# Altium schematic sheet MCU.SchDoc
size 431 x 279 mm; SheetNumber: 2; SheetTotal: 12; ENG_APP_DATE: --/--/--; DSN_APP_DATE: --/--/--; CHK_APP_DATE: --/--/--
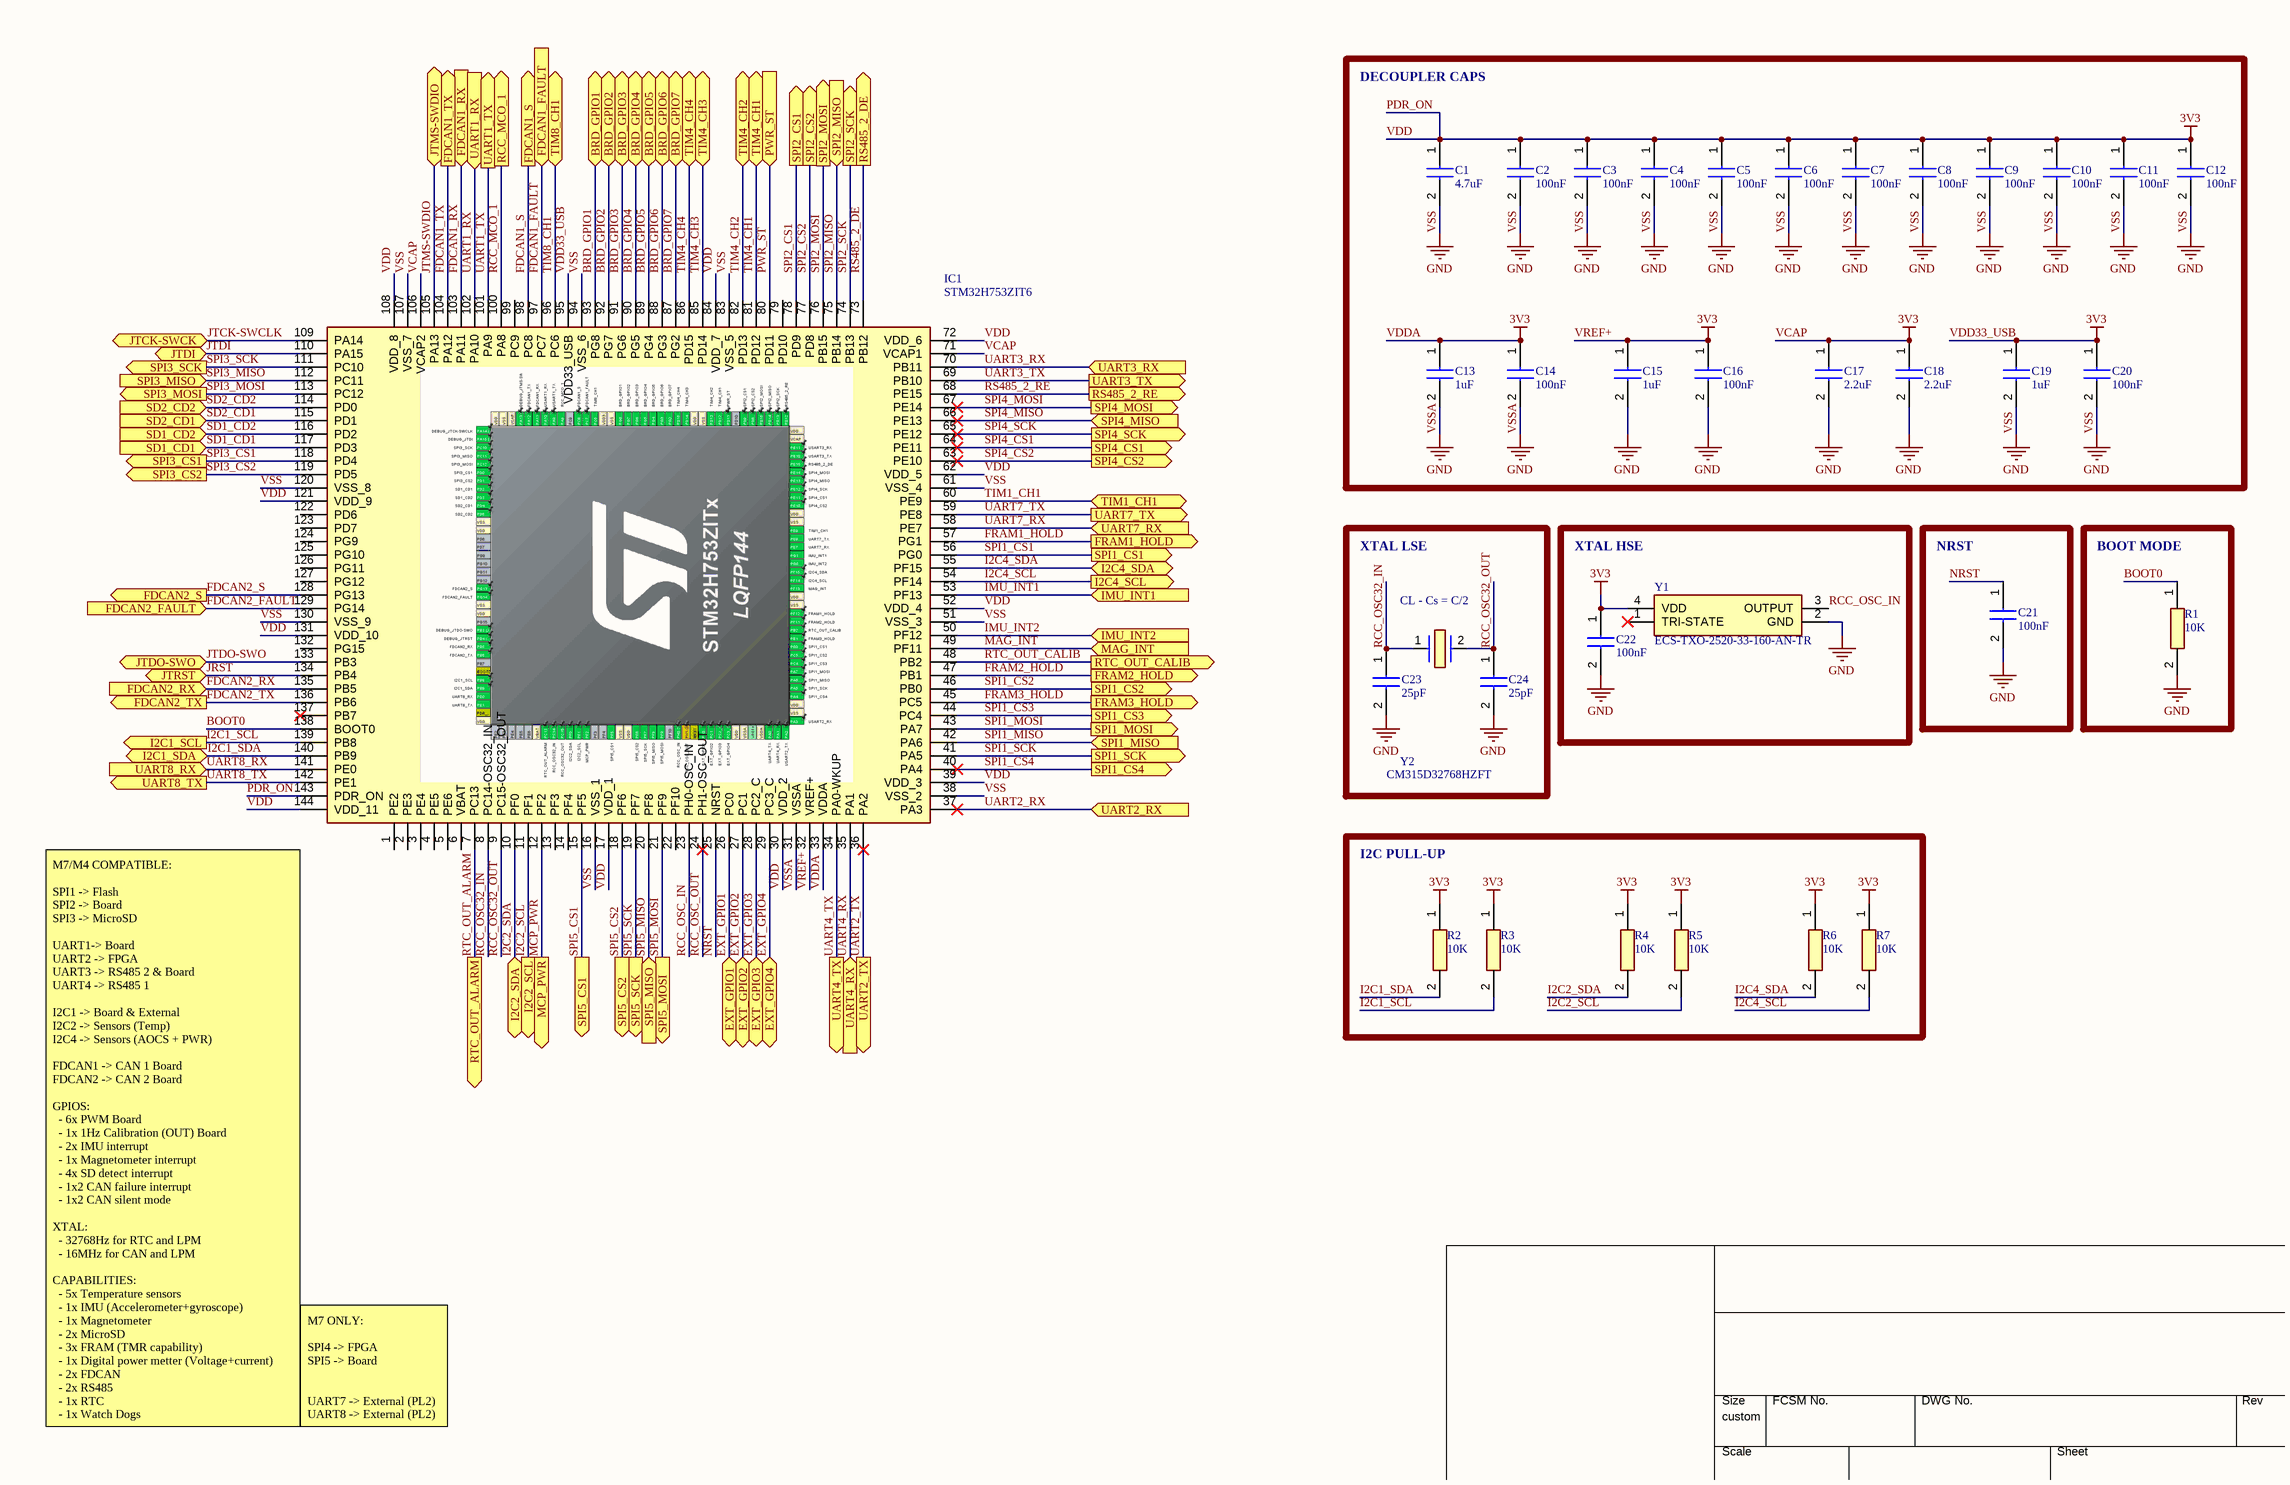
[diagram p0: MCU.SchDoc]

## Parts
C1  4.7uF  [CAPC1608X90N]
C2  100nF  [CAPC1608X95N]
C3  100nF  [CAPC1608X95N]
C4  100nF  [CAPC1608X95N]
C5  100nF  [CAPC1608X95N]
C6  100nF  [CAPC1608X95N]
C7  100nF  [CAPC1608X95N]
C8  100nF  [CAPC1608X95N]
C9  100nF  [CAPC1608X95N]
C10  100nF  [CAPC1608X95N]
C11  100nF  [CAPC1608X95N]
C12  100nF  [CAPC1608X95N]
C13  1uF  [CAPC1608X90N]
C14  100nF  [CAPC1608X95N]
C15  1uF  [CAPC1608X90N]
C16  100nF  [CAPC1608X95N]
C17  2.2uF  [CAPC1608X90N]
C18  2.2uF  [CAPC1608X90N]
C19  1uF  [CAPC1608X90N]
C20  100nF  [CAPC1608X95N]
C21  100nF  [CAPC1608X95N]
C22  100nF  [CAPC1608X95N]
C23  25pF  [CAPC1608X90N]
C24  25pF  [CAPC1608X90N]
IC1  STM32H753ZIT6  [QFP50P2200X2200X160-144N]
R1  10K  [RESC1508X50N]
R2  10K  [RESC1508X50N]
R3  10K  [RESC1508X50N]
R4  10K  [RESC1508X50N]
R5  10K  [RESC1508X50N]
R6  10K  [RESC1508X50N]
R7  10K  [RESC1508X50N]
Y1  ECS-TXO-2520-33-160-AN-TR  [ECSTXO252033160ANTR]
Y2  CM315D32768HZFT  [CM315D32768HZFT]

## Blocks framed on the sheet
DECOUPLER CAPS: C1-C20
XTAL LSE: C23 C24 Y2
XTAL HSE: C22 Y1
NRST: C21
BOOT MODE: R1
I2C PULL-UP: R2-R7

## Ports
BRD_GPIO1 (bidir), BRD_GPIO2 (bidir), BRD_GPIO3 (bidir), BRD_GPIO4 (bidir), BRD_GPIO5 (bidir), BRD_GPIO6 (bidir), BRD_GPIO7 (bidir), EXT_GPIO1 (bidir), EXT_GPIO2 (bidir), EXT_GPIO3 (bidir), EXT_GPIO4 (bidir), FDCAN1_FAULT (in), FDCAN1_RX (in), FDCAN1_S (out), FDCAN1_TX (out), FDCAN2_FAULT (in), FDCAN2_RX (in), FDCAN2_S (out), FDCAN2_TX (out), FRAM1_HOLD (out), FRAM2_HOLD (out), FRAM3_HOLD (out), I2C1_SCL (out), I2C1_SDA (bidir), I2C2_SCL (out), I2C2_SDA (bidir), I2C4_SCL (out), I2C4_SDA (bidir), IMU_INT1 (in), IMU_INT2 (in), JTCK-SWCK (bidir), JTDI (bidir), JTDO-SWO (bidir), JTMS-SWDIO (bidir), JTRST (bidir), MAG_INT (in), MCP_PWR (out), PWR_ST (in), RCC_MCO_1 (out), RS485_2_DE (out), RS485_2_RE (out), RTC_OUT_ALARM (out), RTC_OUT_CALIB (out), SD1_CD1 (in), SD1_CD2 (in), SD2_CD1 (in), SD2_CD2 (in), SPI1_CS1 (out), SPI1_CS2 (out), SPI1_CS3 (out), SPI1_CS4 (out), SPI1_MISO (in), SPI1_MOSI (out), SPI1_SCK (out), SPI2_CS1 (out), SPI2_CS2 (out), SPI2_MISO (in), SPI2_MOSI (out), SPI2_SCK (out), SPI3_CS1 (out), SPI3_CS2 (out), SPI3_MISO (in), SPI3_MOSI (out), SPI3_SCK (out), SPI4_CS1 (out), SPI4_CS2 (out), SPI4_MISO (in), SPI4_MOSI (out), SPI4_SCK (out), SPI5_CS1 (out), SPI5_CS2 (out), SPI5_MISO (in), SPI5_MOSI (out), SPI5_SCK (out), TIM1_CH1 (bidir), TIM4_CH1 (bidir), TIM4_CH2 (bidir), TIM4_CH3 (bidir), TIM4_CH4 (bidir), TIM8_CH1 (bidir), UART1_RX (in), UART1_TX (out), UART2_RX (in), UART2_TX (out), UART3_RX (in), UART3_TX (out), UART4_RX (in), UART4_TX (out), UART7_RX (in), UART7_TX (out), UART8_RX (in), UART8_TX (out)

## Nets
PDR_ON: C1.1 C2.1 C3.1 C4.1 C5.1 C6.1 C7.1 C8.1 C9.1 C10.1 C11.1 C12.1 C13.1 C14.1 C15.1 C16.1 C17.1 C18.1 C19.1 C20.1 C22.1 IC1.17(VDD_1) IC1.30(VDD_2) IC1.32(VREF+) IC1.33(VDDA) IC1.39(VDD_3) IC1.52(VDD_4) IC1.62(VDD_5) IC1.71(VCAP1) IC1.72(VDD_6) IC1.84(VDD_7) IC1.95(VDD33_USB) IC1.106(VCAP2) IC1.108(VDD_8) IC1.121(VDD_9) IC1.131(VDD_10) IC1.143(PDR_ON) IC1.144(VDD_11) R2.1 R3.1 R4.1 R5.1 R6.1 R7.1 Y1.4(VDD)  [also labelled 3V3, VCAP, VDD, VDD33_USB, VDDA, VREF+]
VSS: C1.2 C2.2 C3.2 C4.2 C5.2 C6.2 C7.2 C8.2 C9.2 C10.2 C11.2 C12.2 C13.2 C14.2 C15.2 C16.2 C17.2 C18.2 C19.2 C20.2 C21.2 C22.2 C23.2 C24.2 IC1.16(VSS_1) IC1.31(VSSA) IC1.38(VSS_2) IC1.51(VSS_3) IC1.61(VSS_4) IC1.83(VSS_5) IC1.94(VSS_6) IC1.107(VSS_7) IC1.120(VSS_8) IC1.130(VSS_9) R1.2 Y1.2(GND)  [also labelled GND, VSSA]
BOOT0: IC1.138(BOOT0) R1.1
BRD_GPIO1: IC1.93(PG8) ; port BRD_GPIO1
BRD_GPIO2: IC1.92(PG7) ; port BRD_GPIO2
BRD_GPIO3: IC1.91(PG6) ; port BRD_GPIO3
BRD_GPIO4: IC1.90(PG5) ; port BRD_GPIO4
BRD_GPIO5: IC1.89(PG4) ; port BRD_GPIO5
BRD_GPIO6: IC1.88(PG3) ; port BRD_GPIO6
BRD_GPIO7: IC1.87(PG2) ; port BRD_GPIO7
EXT_GPIO1: IC1.26(PC0) ; port EXT_GPIO1
EXT_GPIO2: IC1.27(PC1) ; port EXT_GPIO2
EXT_GPIO3: IC1.28(PC2_C) ; port EXT_GPIO3
EXT_GPIO4: IC1.29(PC3_C) ; port EXT_GPIO4
FDCAN1_FAULT: IC1.97(PC7) ; port FDCAN1_FAULT
FDCAN1_RX: IC1.103(PA11) ; port FDCAN1_RX
FDCAN1_S: IC1.98(PC8) ; port FDCAN1_S
FDCAN1_TX: IC1.104(PA12) ; port FDCAN1_TX
FDCAN2_FAULT: IC1.129(PG14) ; port FDCAN2_FAULT
FDCAN2_RX: IC1.135(PB5) ; port FDCAN2_RX
FDCAN2_S: IC1.128(PG13) ; port FDCAN2_S
FDCAN2_TX: IC1.136(PB6) ; port FDCAN2_TX
FRAM1_HOLD: IC1.57(PG1) ; port FRAM1_HOLD
FRAM2_HOLD: IC1.47(PB1) ; port FRAM2_HOLD
FRAM3_HOLD: IC1.45(PC5) ; port FRAM3_HOLD
I2C1_SCL: IC1.139(PB8) R3.2 ; port I2C1_SCL
I2C1_SDA: IC1.140(PB9) R2.2 ; port I2C1_SDA
I2C2_SCL: IC1.11(PF1) R5.2 ; port I2C2_SCL
I2C2_SDA: IC1.10(PF0) R4.2 ; port I2C2_SDA
I2C4_SCL: IC1.54(PF14) R7.2 ; port I2C4_SCL
I2C4_SDA: IC1.55(PF15) R6.2 ; port I2C4_SDA
IMU_INT1: IC1.53(PF13) ; port IMU_INT1
IMU_INT2: IC1.50(PF12) ; port IMU_INT2
JRST: IC1.134(PB4) ; port JTRST
JTCK-SWCLK: IC1.109(PA14) ; port JTCK-SWCK
JTDI: IC1.110(PA15) ; port JTDI
JTDO-SWO: IC1.133(PB3) ; port JTDO-SWO
JTMS-SWDIO: IC1.105(PA13) ; port JTMS-SWDIO
MAG_INT: IC1.49(PF11) ; port MAG_INT
MCP_PWR: IC1.12(PF2) ; port MCP_PWR
NRST: C21.1 IC1.25(NRST)
PWR_ST: IC1.80(PD11) ; port PWR_ST
RCC_MCO_1: IC1.100(PA8) ; port RCC_MCO_1
RCC_OSC32_IN: C23.1 IC1.8(PC14-OSC32_IN) Y2.1
RCC_OSC32_OUT: C24.1 IC1.9(PC15-OSC32_OUT) Y2.2
RCC_OSC_IN: IC1.23(PH0-OSC_IN) Y1.3(OUTPUT)
RCC_OSC_OUT: IC1.24(PH1-OSC_OUT)
RS485_2_DE: IC1.73(PB12) ; port RS485_2_DE
RS485_2_RE: IC1.68(PE15) ; port RS485_2_RE
RTC_OUT_ALARM: IC1.7(PC13) ; port RTC_OUT_ALARM
RTC_OUT_CALIB: IC1.48(PB2) ; port RTC_OUT_CALIB
SD1_CD1: IC1.117(PD3) ; port SD1_CD1
SD1_CD2: IC1.116(PD2) ; port SD1_CD2
SD2_CD1: IC1.115(PD1) ; port SD2_CD1
SD2_CD2: IC1.114(PD0) ; port SD2_CD2
SPI1_CS1: IC1.56(PG0) ; port SPI1_CS1
SPI1_CS2: IC1.46(PB0) ; port SPI1_CS2
SPI1_CS3: IC1.44(PC4) ; port SPI1_CS3
SPI1_CS4: IC1.40(PA4) ; port SPI1_CS4
SPI1_MISO: IC1.42(PA6) ; port SPI1_MISO
SPI1_MOSI: IC1.43(PA7) ; port SPI1_MOSI
SPI1_SCK: IC1.41(PA5) ; port SPI1_SCK
SPI2_CS1: IC1.78(PD9) ; port SPI2_CS1
SPI2_CS2: IC1.77(PD8) ; port SPI2_CS2
SPI2_MISO: IC1.75(PB14) ; port SPI2_MISO
SPI2_MOSI: IC1.76(PB15) ; port SPI2_MOSI
SPI2_SCK: IC1.74(PB13) ; port SPI2_SCK
SPI3_CS1: IC1.118(PD4) ; port SPI3_CS1
SPI3_CS2: IC1.119(PD5) ; port SPI3_CS2
SPI3_MISO: IC1.112(PC11) ; port SPI3_MISO
SPI3_MOSI: IC1.113(PC12) ; port SPI3_MOSI
SPI3_SCK: IC1.111(PC10) ; port SPI3_SCK
SPI4_CS1: IC1.64(PE11) ; port SPI4_CS1
SPI4_CS2: IC1.63(PE10) ; port SPI4_CS2
SPI4_MISO: IC1.66(PE13) ; port SPI4_MISO
SPI4_MOSI: IC1.67(PE14) ; port SPI4_MOSI
SPI4_SCK: IC1.65(PE12) ; port SPI4_SCK
SPI5_CS1: IC1.15(PF5) ; port SPI5_CS1
SPI5_CS2: IC1.18(PF6) ; port SPI5_CS2
SPI5_MISO: IC1.20(PF8) ; port SPI5_MISO
SPI5_MOSI: IC1.21(PF9) ; port SPI5_MOSI
SPI5_SCK: IC1.19(PF7) ; port SPI5_SCK
TIM1_CH1: IC1.60(PE9) ; port TIM1_CH1
TIM4_CH1: IC1.81(PD12) ; port TIM4_CH1
TIM4_CH2: IC1.82(PD13) ; port TIM4_CH2
TIM4_CH3: IC1.85(PD14) ; port TIM4_CH3
TIM4_CH4: IC1.86(PD15) ; port TIM4_CH4
TIM8_CH1: IC1.96(PC6) ; port TIM8_CH1
UART1_RX: IC1.102(PA10) ; port UART1_RX
UART1_TX: IC1.101(PA9) ; port UART1_TX
UART2_RX: IC1.37(PA3) ; port UART2_RX
UART2_TX: IC1.36(PA2) ; port UART2_TX
UART3_RX: IC1.70(PB11) ; port UART3_RX
UART3_TX: IC1.69(PB10) ; port UART3_TX
UART4_RX: IC1.35(PA1) ; port UART4_RX
UART4_TX: IC1.34(PA0-WKUP) ; port UART4_TX
UART7_RX: IC1.58(PE7) ; port UART7_RX
UART7_TX: IC1.59(PE8) ; port UART7_TX
UART8_RX: IC1.141(PE0) ; port UART8_RX
UART8_TX: IC1.142(PE1) ; port UART8_TX

Not connected (* = marked no-connect by the designer): IC1 1(PE2) 2(PE3) 3(PE4) 4(PE5) 5(PE6) 6(VBAT) 13(PF3) 14(PF4) 22(PF10) 79(PD10) 99(PC9) 122(PD6) 123(PD7) 124(PG9) 125(PG10) 126(PG11) 127(PG12) 132(PG15) 137(PB7)*; Y1 1(TRI-STATE)*

## Notes on the sheet
- (near Y2) CL - Cs = C/2
- (near IC1) M7/M4 COMPATIBLE:
  SPI1 -> Flash
  SPI2 -> Board
  SPI3 -> MicroSD
  UART1-> Board
  UART2 -> FPGA
  UART3 -> RS485 2 & Board
  UART4 -> RS485 1
  I2C1 -> Board & External
  I2C2 -> Sensors (Temp)
  I2C4 -> Sensors (AOCS + PWR)
  FDCAN1 -> CAN 1 Board
  FDCAN2 -> CAN 2 Board
  GPIOS:
  - 6x PWM Board
  - 1x 1Hz Calibration (OUT) Board
  - 2x IMU interrupt
  - 1x Magnetometer interrupt
  - 4x SD detect interrupt
  - 1x2 CAN failure interrupt
  - 1x2 CAN silent mode
  XTAL:
  - 32768Hz for RTC and LPM
  - 16MHz for CAN and LPM
  CAPABILITIES:
  - 5x Temperature sensors
  - 1x IMU (Accelerometer+gyroscope)
  - 1x Magnetometer
  - 2x MicroSD
  - 3x FRAM (TMR capability)
  - 1x Digital power metter (Voltage+current)
  - 2x FDCAN
  - 2x RS485
  - 1x RTC
  - 1x Watch Dogs
- M7 ONLY:
  SPI4 -> FPGA
  SPI5 -> Board
  UART7 -> External (PL2)
  UART8 -> External (PL2)
- DWG. NO.
- REV.
- SHT.
- THIS DOCUMENT AND THE DATA DISCLOSED HEREIN OR HEREWITH IS THE PROPERTY OF ALTIUM LIMITED AND MAY BE FREELY DISTRIBUTED IN WHOLE. NO RIGHTS ARE RESERVED OR EXPRESS OR IMPLIED WARANTEE GIVEN.
- REVISION
- DESCRIPTION
- DATE
- APPROVED
- ENG:
- APPROVALS
- PROJECT
- DSN:
- CHK:
- REFERENCE DOCUMENTS
- PROJECT REVISION:
- TITLE
- DOCUMENT REVISION:
- DESIGN ITEM:
- BOM:
- FAB DWG:
- PCB DWG:
- ASSY DWG:
- SCALE:
- SIZE
- B
- CAGE CODE
- FILE NAME
- DWG NO.
- SHEET
- OF
- REV

## Library data of the parts
C1 = CL10A475KP8NNNC: 4.7 µF ±10% 10V Ceramic Capacitor X5R 0603 (1608 Metric); Manufacturer_Name: SAMSUNG; Datasheet Link: https://www.arrow.com/en/products/cl10a475kp8nnnc/samsung-electro-mechanics; Height: 0.9mm; Manufacturer_Part_Number: CL10A475KP8NNNC; Mouser Part Number: 187-CL10A475KP8NNNC; Mouser Price/Stock: https://www.mouser.co.uk/ProductDetail/Samsung-Electro-Mechanics/CL10A475KP8NNNC?qs=hqM3L16%252BxlfQRmkWsZz5vA%3D%3D; Arrow Part Number: CL10A475KP8NNNC; Arrow Price/Stock: https://www.arrow.com/en/products/cl10a475kp8nnnc/samsung-electro-mechanics?region=europe
C2-C12 C14 C16 C20-C22 = C0603C104M4RAC7867: 0.1 µF ±20% 16V Ceramic Capacitor X7R 0603 (1608 Metric); Manufacturer_Name: KEMET; Datasheet Link: https://www.arrow.com/en/products/c0603c104m4rac7867/kemet-corporation?region=nac; Height: 0.95mm; Manufacturer_Part_Number: C0603C104M4RAC7867; Mouser Part Number: N/A; Mouser Price/Stock: https://www.mouser.co.uk/ProductDetail/KEMET/C0603C104M4RAC7867?qs=nAEW9fCjKd%252BI998RVtZhZQ%3D%3D; Arrow Part Number: C0603C104M4RAC7867; Arrow Price/Stock: https://www.arrow.com/en/products/c0603c104m4rac7867/kemet-corporation?region=europe
C13 C15 C19 = CL10A105KA8NNNC: 1 µF ±10% 25V Ceramic Capacitor X5R 0603 (1608 Metric); Manufacturer_Name: SAMSUNG; Datasheet Link: http://uk.rs-online.com/web/p/products/7664838; Height: 0.9mm; Manufacturer_Part_Number: CL10A105KA8NNNC; Mouser Part Number: 187-CL10A105KA8NNNC; Mouser Price/Stock: https://www.mouser.co.uk/ProductDetail/Samsung-Electro-Mechanics/CL10A105KA8NNNC?qs=hqM3L16%252BxldY%252BnK4KzDJVg%3D%3D; Arrow Part Number: CL10A105KA8NNNC; Arrow Price/Stock: https://www.arrow.com/en/products/cl10a105ka8nnnc/samsung-electro-mechanics?region=europe
C17 C18 = CL10A225KO8NNNC: 2.2 µF ±10% 16V Ceramic Capacitor X5R 0603 (1608 Metric); Manufacturer_Name: SAMSUNG; Datasheet Link: https://lcsc.componentsearchengine.com/Datasheets/2/CL10A225KO8NNNC.pdf; Height: 0.9mm; Manufacturer_Part_Number: CL10A225KO8NNNC; Mouser Part Number: 187-CL10A225KO8NNNC; Mouser Price/Stock: https://www.mouser.co.uk/ProductDetail/Samsung-Electro-Mechanics/CL10A225KO8NNNC?qs=hqM3L16%252BxlecoJxUp5hKOw%3D%3D; Arrow Part Number: CL10A225KO8NNNC; Arrow Price/Stock: https://www.arrow.com/en/products/cl10a225ko8nnnc/samsung-electro-mechanics?region=nac
C23 C24 = GCM1885C2A220FA16D: 22 pF ±1% 100V Ceramic Capacitor C0G, NP0 0603 (1608 Metric); Manufacturer_Name: Murata Electronics; Datasheet Link: https://www.murata.com/en-global/api/pdfdownloadapi?cate=luCeramicCapacitorsSMD&partno=GCM1885C2A220FA16%23; Height: 0.9mm; Manufacturer_Part_Number: GCM1885C2A220FA16D
IC1 = STM32H753ZIT6: ARM® Cortex®-M7 STM32H7 Microcontroller IC 32-Bit Single-Core 480MHz 2MB (2M x 8) FLASH 144-LQFP (20x20); Manufacturer_Name: STMicroelectronics; Datasheet Link: http://www.st.com/content/ccc/resource/technical/document/datasheet/group3/01/21/00/39/12/c9/4c/f1/DM00388325/files/DM00388325.pdf/jcr:content/translations/en.DM00388325.pdf; Height: 1.6mm; Manufacturer_Part_Number: STM32H753ZIT6; Mouser Part Number: 511-STM32H753ZIT6; Mouser Price/Stock: https://www.mouser.co.uk/ProductDetail/STMicroelectronics/STM32H753ZIT6?qs=u4fy%2FsgLU9PzR9vtNNw%2FMw%3D%3D; Arrow Part Number: STM32H753ZIT6; Arrow Price/Stock: https://www.arrow.com/en/products/stm32h753zit6/stmicroelectronics?region=nac
R1-R7 = RNCP0603FTD10K0: 10 kOhms ±1% 0.125W, 1/8W Chip Resistor 0603 (1608 Metric) Anti-Sulfur Thin Film; Manufacturer_Name: Stackpole Electronics; Datasheet Link: https://cs.seielect.com/catalog/SEI-RNCP.pdf; Height: 0.5mm; Manufacturer_Part_Number: RNCP0603FTD10K0; Mouser Part Number: 708-RNCP0603FTD10K0; Mouser Price/Stock: https://www.mouser.co.uk/ProductDetail/SEI-Stackpole/RNCP0603FTD10K0?qs=FESYatJ8odL1jmHQSpKOPg%3D%3D; Arrow Part Number: RNCP0603FTD10K0; Arrow Price/Stock: https://www.arrow.com/en/products/rncp0603ftd10k0/stackpole-electronics?region=nac
Y1 = ECS-TXO-2520-33-160-AN-TR: 16 MHz TCXO HCMOS Oscillator 3.3V Enable/Disable 4-SMD, No Lead; Manufacturer_Name: ECS; Datasheet Link: https://ecsxtal.com/store/pdf/ECS-TXO-2520.pdf; Height: 1mm; Manufacturer_Part_Number: ECS-TXO-2520-33-160-AN-TR; Mouser Part Number: 520-T2520-33-160-ANT; Mouser Price/Stock: https://www.mouser.co.uk/ProductDetail/ECS/ECS-TXO-2520-33-160-AN-TR?qs=KAq9QXcE8HAE1gcf2ozR9w%3D%3D; Arrow Part Number: ECS-TXO-2520-33-160-AN-TR; Arrow Price/Stock: https://www.arrow.com/en/products/ecs-txo-2520-33-160-an-tr/ecs-international?region=nac
Y2 = CM315D32768HZFT: 32.768 kHz ±5ppm Crystal 12.5pF 70 kOhms 2-SMD, No Lead; Manufacturer_Name: CITIZEN FINEDEVICE; Datasheet Link: http://cfd.citizen.co.jp/cms/cfd/pdf/english/CM315D_E.pdf; Height: 0.9mm; Manufacturer_Part_Number: CM315D32768HZFT; Mouser Part Number: N/A; Mouser Price/Stock: https://www.mouser.co.uk/ProductDetail/Citizen-FineDevice/CM315D32768HZFT?qs=wnTfsH77Xs4JnKs4SU5%252Bgw%3D%3D